# Altium schematic sheet FTDI SCH.schdoc
size 127 x 101 mm
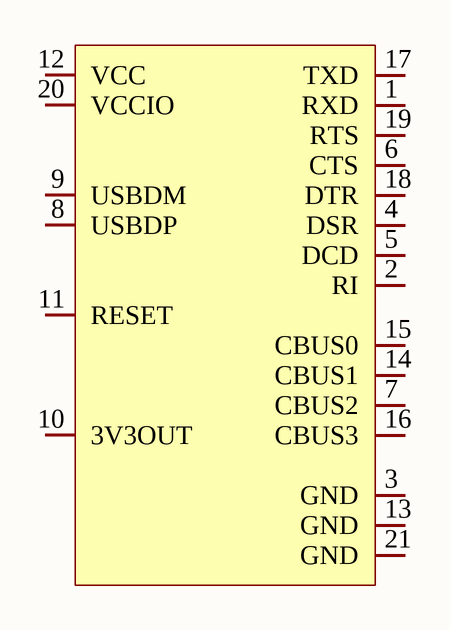
[diagram p0: FTDI SCH.schdoc]

## Parts
U?  FT231XQ-R  [QFN-20_L4.0-W4.0-P0.50-BL-EP2.2]  (value not drawn)

## Nets

Not connected (* = marked no-connect by the designer): U? 1(RXD) 2(RI) 3(GND) 4(DSR) 5(DCD) 6(CTS) 7(CBUS2) 8(USBDP) 9(USBDM) 10(3V3OUT) 11(RESET) 12(VCC) 13(GND) 14(CBUS1) 15(CBUS0) 16(CBUS3) 17(TXD) 18(DTR) 19(RTS) 20(VCCIO) 21(GND)

## Library data of the parts
U? = FT231XQ-R: IC USB SERIAL FULL UART 20QFN; Manufacturer: FTDI(飞特帝亚); Add into BOM: yes; Applications Function: USB to UART; Voltage - Supply: 3.3V~5V; Symbol: FT231XQ-R; Device: FT231XQ-R; LCSC Part Name: FT231X USB至全握手UART IC; Supplier Part: C132159; Manufacturer Part: FT231XQ-R; Supplier Footprint: QFN-20-EP(4x4); JLCPCB Part Class: Extended Part; Datasheet: https://atta.szlcsc.com/upload/public/pdf/source/20171113/C132160_15105610735521115430.pdf; Supplier: LCSC; Convert to PCB: yes; Protocol: -; Operating Temperature: -40℃~+85℃; LCSC Part Number: C132159